# EAGLE schematic slamcAR01 (EAGLE 8.4.0)
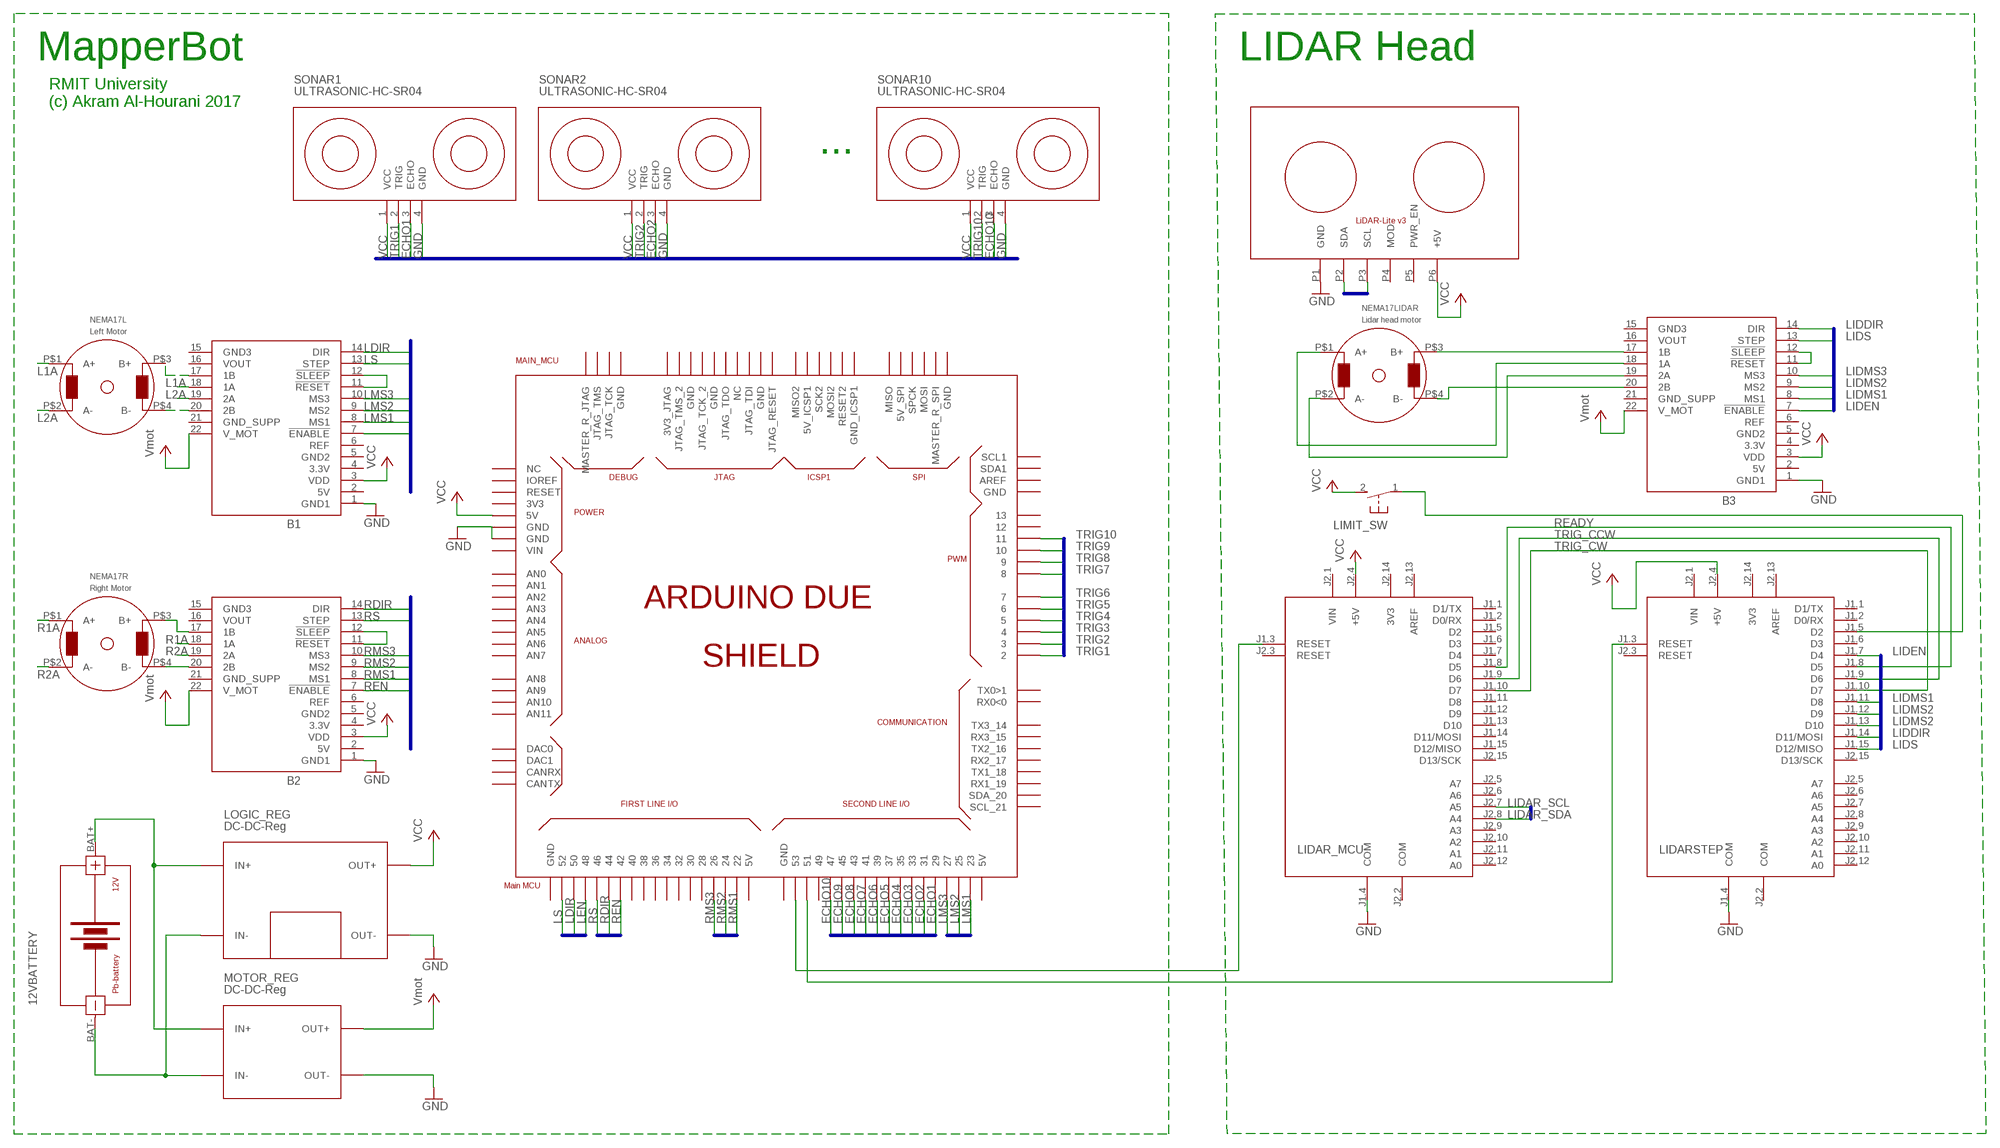
[diagram p0: schematic, sheet 1]

## Parts
12VBATTERY  BATTERY-LI-MH12210  [BATTERY-LI-MH12210]
B1  POLOLU_1183  [POLOLU_1183]
B2  POLOLU_1183  [POLOLU_1183]
B3  POLOLU_1183  [POLOLU_1183]
LIDAR_MCU  ARDUINO_NANO2  [ARDUINO_NANO2]
LIDARSTEP  ARDUINO_NANO2  [ARDUINO_NANO2]
LIMIT_SW  31-XX  [B3F-31XX]
LOGIC_REG  DC-DC-Reg  DC-DC-LM2596-DISP  [DC-DC-LM2596-DISP]
MAIN_MCU  Main MCU  ARDUINO_DUE_SHIELD  [ARDUINO_DUE_SHIELD]
MOTOR_REG  DC-DC-Reg  DC-DC-STEP-DOWN-LM2596  [DC-DC-STEP-DOWN-LM2596]
NEMA17L  Left Motor  X25_168  [X25_168]
NEMA17LIDAR  Lidar head motor  X25_168  [X25_168]
NEMA17R  Right Motor  X25_168  [X25_168]
SONAR1  ULTRASONIC-HC-SR04  [ULTRASONIC-HC-SR04]
SONAR2  ULTRASONIC-HC-SR04  [ULTRASONIC-HC-SR04]
SONAR10  ULTRASONIC-HC-SR04  [ULTRASONIC-HC-SR04]
U$6  LIDAR  [LIDAR]

## Nets
ECHO1: MAIN_MCU.29 SONAR1.3(ECHO)
ECHO2: MAIN_MCU.31 SONAR2.3(ECHO)
ECHO3: MAIN_MCU.33
ECHO4: MAIN_MCU.35
ECHO5: MAIN_MCU.37
ECHO6: MAIN_MCU.39
ECHO7: MAIN_MCU.41
ECHO8: MAIN_MCU.43
ECHO9: MAIN_MCU.45
ECHO10: MAIN_MCU.47 SONAR10.3(ECHO)
GND: B2.1(GND1) B3.1(GND1) LIDAR_MCU.J1.4(COM) LIDARSTEP.J1.4(COM) LOGIC_REG.OUT- MAIN_MCU.GND MAIN_MCU.GND_1(GND) MOTOR_REG.OUT- SONAR1.4(GND) SONAR2.4(GND) SONAR10.4(GND) U$6.P1(GND)
L1A: B1.18(1A) NEMA17L.P$1(A+)
L2A: B1.19(2A) NEMA17L.P$2(A-)
LDIR: B1.14(DIR) MAIN_MCU.50
LEN: B1.7(!ENABLE) MAIN_MCU.48
LIDAR_SCL: LIDAR_MCU.J2.7(A5)
LIDAR_SDA: LIDAR_MCU.J2.8(A4) U$6.P2(SDA) U$6.P3(SCL)
LIDDIR: B3.14(DIR) LIDARSTEP.J1.14(D11/MOSI)
LIDEN: B3.7(!ENABLE) LIDARSTEP.J1.7(D4)
LIDMS1: B3.8(MS1) LIDARSTEP.J1.11(D8)
LIDMS2: B3.9(MS2) LIDARSTEP.J1.12(D9) LIDARSTEP.J1.13(D10)
LIDMS3: B3.10(MS3)
LIDS: B3.13(STEP) LIDARSTEP.J1.15(D12/MISO)
LMS1: B1.8(MS1) MAIN_MCU.23
LMS2: B1.9(MS2) MAIN_MCU.25
LMS3: B1.10(MS3) MAIN_MCU.27
LS: B1.13(STEP) MAIN_MCU.52
N$1: B1.17(1B) NEMA17L.P$3(B+)
N$2: B1.20(2B) NEMA17L.P$4(B-)
N$3: B2.17(1B) NEMA17R.P$3(B+)
N$4: B2.20(2B) NEMA17R.P$4(B-)
N$5: B1.11(!RESET) B1.12(!SLEEP)
N$6: B2.11(!RESET) B2.12(!SLEEP)
N$7: B1.1(GND1) ; supply symbol labelled GND
N$8: LIDAR_MCU.J1.3(RESET) MAIN_MCU.53
N$9: LIDARSTEP.J1.3(RESET) MAIN_MCU.51
N$11: B3.17(1B) NEMA17LIDAR.P$3(B+)
N$12: B3.20(2B) NEMA17LIDAR.P$4(B-)
N$13: B3.19(2A) NEMA17LIDAR.P$2(A-)
N$14: B3.18(1A) NEMA17LIDAR.P$1(A+)
N$15: B3.11(!RESET) B3.12(!SLEEP)
N$16: LIDARSTEP.J1.5(D2) LIMIT_SW.1(P)
N$18: 12VBATTERY.BAT+ LOGIC_REG.IN+ MOTOR_REG.IN+
N$19: 12VBATTERY.BAT- LOGIC_REG.IN- MOTOR_REG.IN-
R1A: B2.18(1A) NEMA17R.P$1(A+)
R2A: B2.19(2A) NEMA17R.P$2(A-)
RDIR: B2.14(DIR) MAIN_MCU.44
READY: LIDAR_MCU.J1.8(D5) LIDARSTEP.J1.8(D5)
REN: B2.7(!ENABLE) MAIN_MCU.42
RMS1: B2.8(MS1) MAIN_MCU.22
RMS2: B2.9(MS2) MAIN_MCU.24
RMS3: B2.10(MS3) MAIN_MCU.26
RS: B2.13(STEP) MAIN_MCU.46
TRIG1: MAIN_MCU.2 SONAR1.2(TRIG)
TRIG2: MAIN_MCU.3 SONAR2.2(TRIG)
TRIG3: MAIN_MCU.4
TRIG4: MAIN_MCU.5
TRIG5: MAIN_MCU.6
TRIG6: MAIN_MCU.7
TRIG7: MAIN_MCU.8
TRIG8: MAIN_MCU.9
TRIG9: MAIN_MCU.10
TRIG10: MAIN_MCU.11 SONAR10.2(TRIG)
TRIG_CCW: LIDAR_MCU.J1.9(D6) LIDARSTEP.J1.9(D6)
TRIG_CW: LIDAR_MCU.J1.10(D7) LIDARSTEP.J1.10(D7)
VCC: B1.3(VDD) B1.22(V_MOT) B2.3(VDD) B2.22(V_MOT) B3.3(VDD) B3.22(V_MOT) LIDAR_MCU.J2.4(+5V) LIDARSTEP.J2.4(+5V) LIMIT_SW.2(S) LOGIC_REG.OUT+ MAIN_MCU.5V0(5V) MOTOR_REG.OUT+ SONAR1.1(VCC) SONAR2.1(VCC) SONAR10.1(VCC) U$6.P6(+5V) ; supply symbol labelled Vmot
Unconnected: B1.2(5V) B1.4(3.3V) B1.5(GND2) B1.6(REF) B1.15(GND3) B1.16(VOUT) B1.21(GND_SUPP) B2.2(5V) B2.4(3.3V) B2.5(GND2) B2.6(REF) B2.15(GND3) B2.16(VOUT) B2.21(GND_SUPP) B3.2(5V) B3.4(3.3V) B3.5(GND2) B3.6(REF) B3.15(GND3) B3.16(VOUT) B3.21(GND_SUPP) LIDAR_MCU.J1.1(D1/TX) LIDAR_MCU.J1.2(D0/RX) LIDAR_MCU.J1.5(D2) LIDAR_MCU.J1.6(D3) LIDAR_MCU.J1.7(D4) LIDAR_MCU.J1.11(D8) LIDAR_MCU.J1.12(D9) LIDAR_MCU.J1.13(D10) LIDAR_MCU.J1.14(D11/MOSI) LIDAR_MCU.J1.15(D12/MISO) LIDAR_MCU.J2.3(RESET) LIDAR_MCU.J2.5(A7) LIDAR_MCU.J2.6(A6) LIDAR_MCU.J2.9(A3) LIDAR_MCU.J2.10(A2) LIDAR_MCU.J2.11(A1) LIDAR_MCU.J2.12(A0) LIDAR_MCU.J2.15(D13/SCK) LIDARSTEP.J1.1(D1/TX) LIDARSTEP.J1.2(D0/RX) LIDARSTEP.J1.6(D3) LIDARSTEP.J2.3(RESET) LIDARSTEP.J2.5(A7) LIDARSTEP.J2.6(A6) LIDARSTEP.J2.7(A5) LIDARSTEP.J2.8(A4) LIDARSTEP.J2.9(A3) LIDARSTEP.J2.10(A2) LIDARSTEP.J2.11(A1) LIDARSTEP.J2.12(A0) LIDARSTEP.J2.15(D13/SCK) MAIN_MCU.0(RX0<0) MAIN_MCU.1(TX0>1) MAIN_MCU.3V3 MAIN_MCU.3V3_JTAG MAIN_MCU.5V0_1(5V) MAIN_MCU.5V0_2(5V) MAIN_MCU.5V_2(5V_SPI) MAIN_MCU.5V_ICSP1 MAIN_MCU.12 MAIN_MCU.13 MAIN_MCU.14(TX3_14) MAIN_MCU.15(RX3_15) MAIN_MCU.16(TX2_16) MAIN_MCU.17(RX2_17) MAIN_MCU.18(TX1_18) MAIN_MCU.19(RX1_19) MAIN_MCU.20(SDA_20) MAIN_MCU.21(SCL_21) MAIN_MCU.28 MAIN_MCU.30 MAIN_MCU.32 MAIN_MCU.34 MAIN_MCU.36 MAIN_MCU.38 MAIN_MCU.40 MAIN_MCU.49 MAIN_MCU.A0(AN0) MAIN_MCU.A1(AN1) MAIN_MCU.A2(AN2) MAIN_MCU.A3(AN3) MAIN_MCU.A4(AN4) MAIN_MCU.A5(AN5) MAIN_MCU.A6(AN6) MAIN_MCU.A7(AN7) MAIN_MCU.A8(AN8) MAIN_MCU.A9(AN9) MAIN_MCU.A10(AN10) MAIN_MCU.A11(AN11) MAIN_MCU.AREF MAIN_MCU.CANRX MAIN_MCU.CANTX MAIN_MCU.DAC0 MAIN_MCU.DAC1 MAIN_MCU.GND_2(GND) MAIN_MCU.GND_3(GND) MAIN_MCU.GND_4(GND) MAIN_MCU.GND_5(GND) MAIN_MCU.GND_7(GND) MAIN_MCU.GND_8(GND) MAIN_MCU.GND_9(GND) MAIN_MCU.GND_10(GND) MAIN_MCU.GND_ICSP1 MAIN_MCU.IOREF MAIN_MCU.JTAG_RESET MAIN_MCU.JTAG_TCK MAIN_MCU.JTAG_TCK_2 MAIN_MCU.JTAG_TDI MAIN_MCU.JTAG_TDO MAIN_MCU.JTAG_TMS MAIN_MCU.JTAG_TMS_2 MAIN_MCU.MASTER_RESET_JTAG(MASTER_R_JTAG) MAIN_MCU.MASTER_RESET_SPI(MASTER_R_SPI) MAIN_MCU.MISO MAIN_MCU.MISO2 MAIN_MCU.MOSI MAIN_MCU.MOSI2 MAIN_MCU.NC_2(NC) MAIN_MCU.NC_5(NC) MAIN_MCU.RESET MAIN_MCU.RESET2 MAIN_MCU.SCK2 MAIN_MCU.SCL1 MAIN_MCU.SDA1 MAIN_MCU.SPCK MAIN_MCU.VIN U$6.P4(MOD) U$6.P5(PWR_EN)

## Buses
LMS[1..3],LDIR,LS,LEN
RMS[1..3],RDIR,RS,REN
TRIG[1..10],ECHO[1..10],GND,VCC
LIDAR_SCL,LIDAR_SDA
LIDMS[1..3],LIDDIR,LIDS,LIDEN

## Notes on the sheet
- MapperBot | LIDAR Head
- RMIT University
  (c) Akram Al-Hourani 2017
- ...

## Power pins joined to a net without a drawn wire
3V3: LIDAR_MCU.J2.14(3V3) LIDARSTEP.J2.14(3V3)
AREF: LIDAR_MCU.J2.13(AREF) LIDARSTEP.J2.13(AREF)
COM: LIDAR_MCU.J2.2(COM) LIDARSTEP.J2.2(COM)
VIN: LIDAR_MCU.J2.1(VIN) LIDARSTEP.J2.1(VIN)

## Library data of the parts
12VBATTERY = eBayModules:BATTERY-LI-MH12210: Lithium-Ion MH12210 Rechargeable Battery Panasonic NCR18650PF battery datasheet available here: https://industrial.panasonic.com/cdbs/www-data/pdf2/ACI4000/ACI4000C12.pdf Click here to find device on ebay.com <http://www.ebay.com/sch/ncr18650b+battery>
B1-B3 = pololu:POLOLU_1183: Pololu 1183 Carrier board or breakout board for Allegro?s A4988 DMOS Microstepping Driver with Translator and Overcurrent Protection. The board has two voltage regulators (5 V and 3.3 V), eliminating the need for separate logic and motor supplies. The driver features adjustable current limiting, overcurrent protection, and five different microstep resolutions. It operates from 8 ? 35 V and can deliver up to 2 A per coil. - Simple step and direction control interface - Five different step resolutions - Adjustable current control lets you set the maximum current output with a potentiometer - Intelligent chopping control that automatically selects the correct current decay mode - Over-temperature thermal shutdown, under-voltage lockout, and crossover-current protection - Short-to-ground and shorted-load protection Link to product page <http://www.pololu.com/catalog/product/1183>
LIDAR_MCU LIDARSTEP = arduino_Nano:ARDUINO_NANO2: Arduino Nano2 Auto generated by modulcreator.ulp \;; ANZAHL: 2; MODUL: TRUE; STECKX0: -76200; STECKX1: 76200; STECKY0: 177800; STECKY1: 177800
LIMIT_SW = switch-omron:31-XX: OMRON SWITCH; MPN: B3F-3100; OC_FARNELL: 959704; OC_NEWARK: 36M3582
LOGIC_REG = eBayModules:DC-DC-LM2596-DISP: DC/DC Step-Down Regulator with Voltage Display based on LM2596-ADJ chip More details available here: http://www.instructables.com/id/The-Introduction-of-LM2596-Step-Down-Power-Module-/ LM2596 datasheet available here: http://www.ti.com/lit/ds/symlink/lm2596.pdf Click here to find device on ebay.com <http://www.ebay.com/sch/lm2596+led+voltmeter+40>
MAIN_MCU = arduino_due_shield:ARDUINO_DUE_SHIELD
MOTOR_REG = eBayModules:DC-DC-STEP-DOWN-LM2596: DC/DC Step-Down Regulator based on LM2596-ADJ chip LM2596 datasheet available here: http://www.ti.com/lit/ds/symlink/lm2596.pdf Click here to find device on ebay.com <http://www.ebay.com/sch/lm2596+power+regulator>
NEMA17L NEMA17LIDAR NEMA17R = Stepper_:X25_168: X25168 - Miniature stepper motor for analog gauge
SONAR1 SONAR2 SONAR10 = Sonar:ULTRASONIC-HC-SR04: Ultrasonic Ranging Module HC-SR04 More details available here: http://randomnerdtutorials.com/complete-guide-for-ultrasonic-sensor-hc-sr04/ Click here to find device on ebay.com <http://www.ebay.com/sch/hc+sr04+ultrasonic>
U$6 = akram_Library:LIDAR